# Altium schematic sheet 3d_gyroscope.SchDoc
size A4
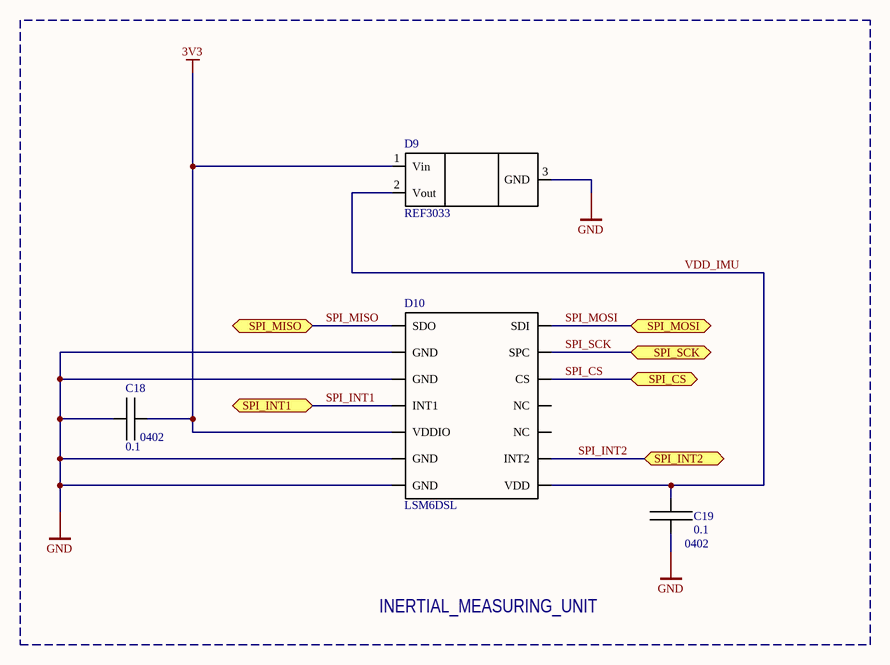
[diagram p0: 3d_gyroscope.SchDoc]

## Parts
C18  0.1  [SMD_0402_C]
C19  0.1  [SMD_0402_C]
D9  REF3033  [SOT23-3L]
D10  LSM6DSL  [LGA14C50P5X4_300X250X86]

## Ports
SPI_CS, SPI_INT1, SPI_INT2, SPI_MISO, SPI_MOSI, SPI_SCK

## Nets
3V3: C18.2 D9.1(Vin) D10.5(VDDIO)
GND: C18.1 C19.1 D9.3(GND) D10.2(GND) D10.3(GND) D10.6(GND) D10.7(GND)
SPI_CS: D10.12(CS) ; port SPI_CS
SPI_INT1: D10.4(INT1) ; port SPI_INT1
SPI_INT2: D10.9(INT2) ; port SPI_INT2
SPI_MISO: D10.1(SDO) ; port SPI_MISO
SPI_MOSI: D10.14(SDI) ; port SPI_MOSI
SPI_SCK: D10.13(SPC) ; port SPI_SCK
VDD_IMU: C19.2 D9.2(Vout) D10.8(VDD)

Not connected (* = marked no-connect by the designer): D10 10(NC) 11(NC)

## Notes on the sheet
- (near C18) 0402
- (near C19) 0402
- INERTIAL_MEASURING_UNIT

## Library data of the parts
C18 C19 = Capacitor
D9 = REF3033: VOLTAGE STATIC SOURCE 3.3V
D10 = LSM6DSL: 3D accelerometer and 3D gyroscope